# EAGLE design s7-Mini-FPGA Development Board (EAGLE 9.7.0)

## Sheet 1 of 2
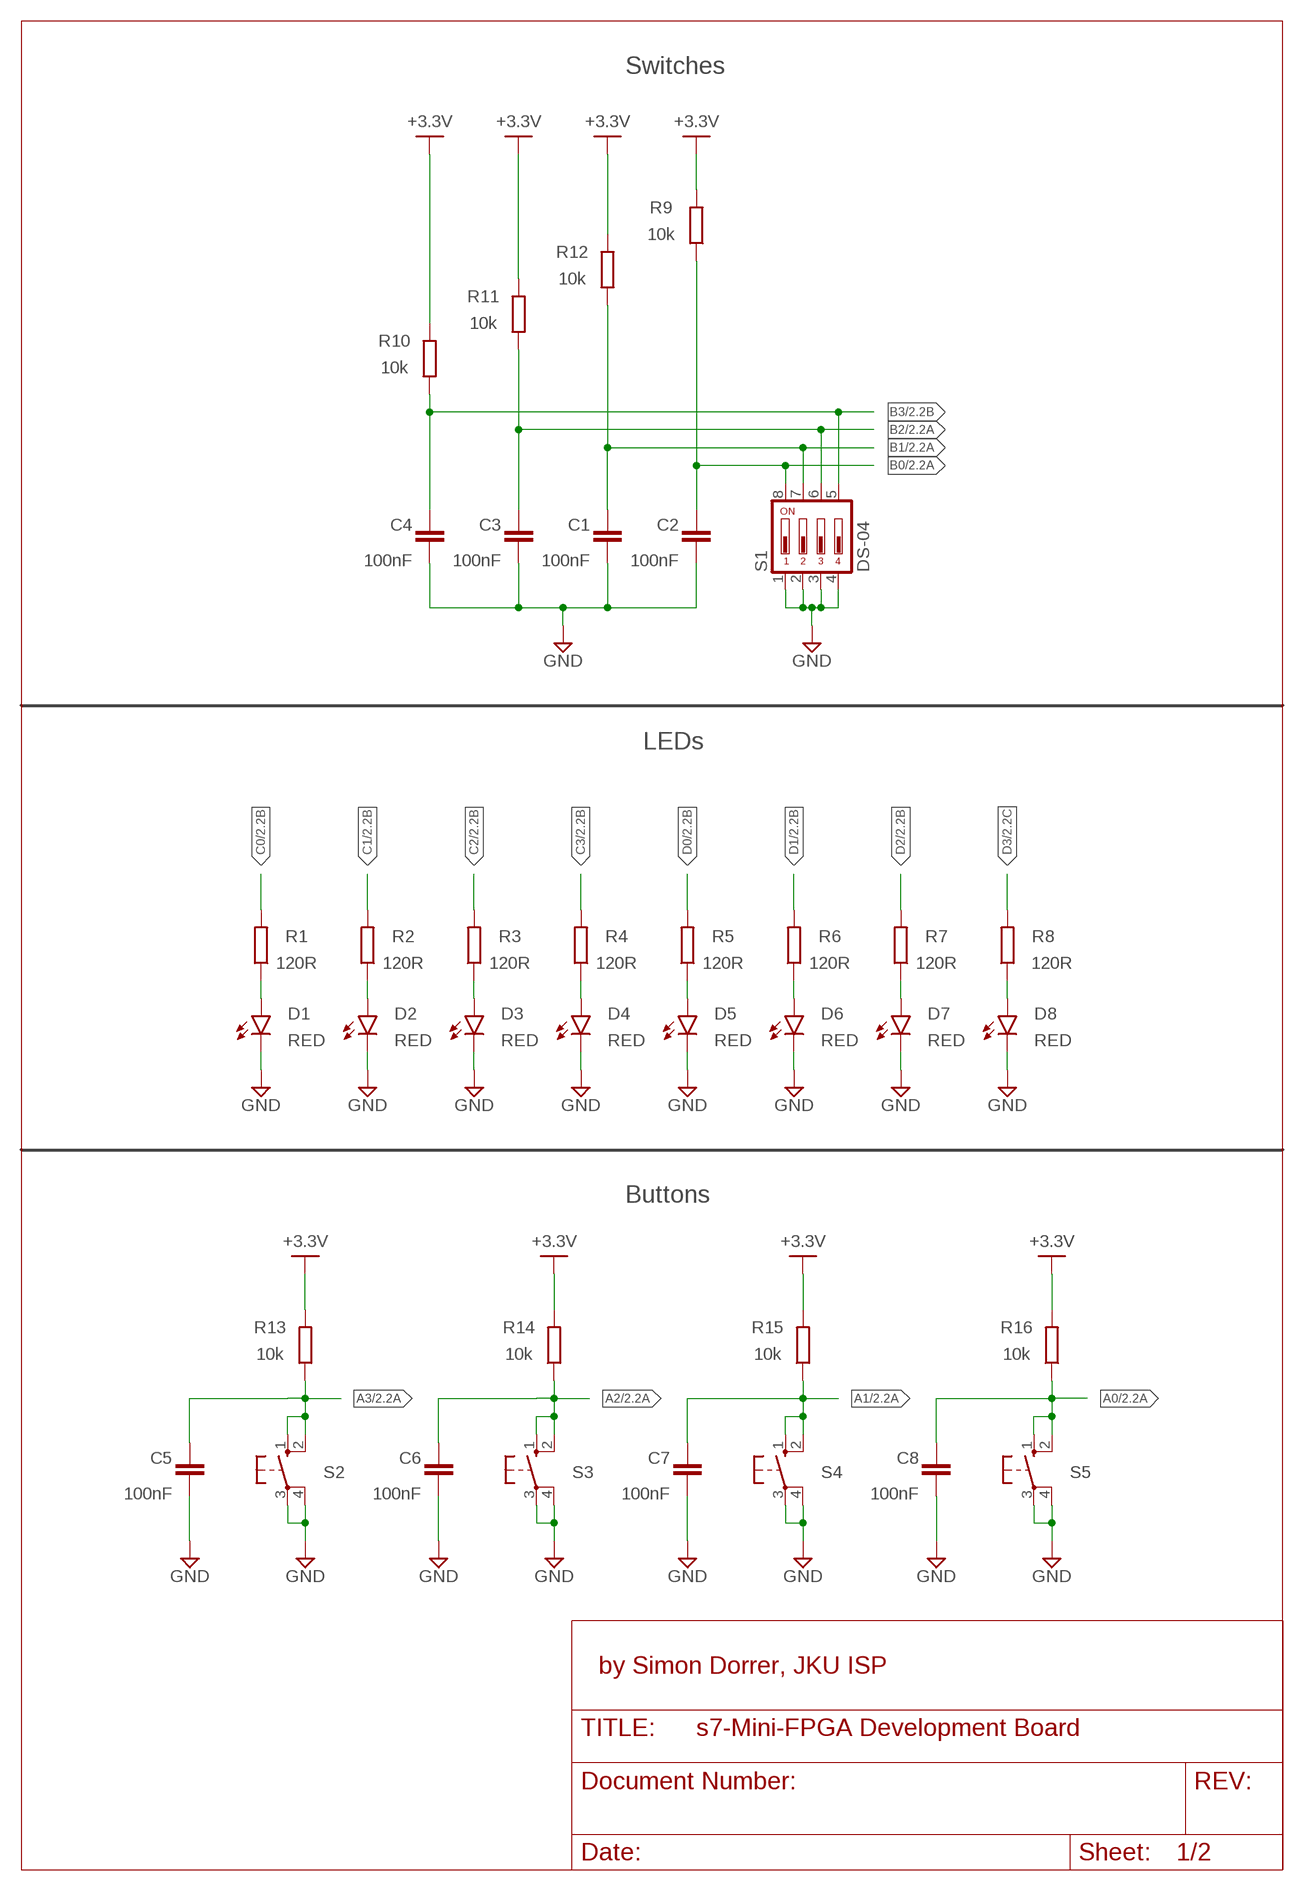
[diagram p0: schematic, sheet 1]

### Parts
C1  100nF  C_CHIP-0805(2012-METRIC)  [CAPC2012X110]
C2  100nF  C_CHIP-0805(2012-METRIC)  [CAPC2012X110]
C3  100nF  C_CHIP-0805(2012-METRIC)  [CAPC2012X110]
C4  100nF  C_CHIP-0805(2012-METRIC)  [CAPC2012X110]
C5  100nF  C_CHIP-0805(2012-METRIC)  [CAPC2012X110]
C6  100nF  C_CHIP-0805(2012-METRIC)  [CAPC2012X110]
C7  100nF  C_CHIP-0805(2012-METRIC)  [CAPC2012X110]
C8  100nF  C_CHIP-0805(2012-METRIC)  [CAPC2012X110]
D1  RED  CHIP-FLAT-R_0805  [LEDC2012X110N_FLAT-R]
D2  RED  CHIP-FLAT-R_0805  [LEDC2012X110N_FLAT-R]
D3  RED  CHIP-FLAT-R_0805  [LEDC2012X110N_FLAT-R]
D4  RED  CHIP-FLAT-R_0805  [LEDC2012X110N_FLAT-R]
D5  RED  CHIP-FLAT-R_0805  [LEDC2012X110N_FLAT-R]
D6  RED  CHIP-FLAT-R_0805  [LEDC2012X110N_FLAT-R]
D7  RED  CHIP-FLAT-R_0805  [LEDC2012X110N_FLAT-R]
D8  RED  CHIP-FLAT-R_0805  [LEDC2012X110N_FLAT-R]
R1  120R  R_CHIP-0805(2012-METRIC)  [RESC2012X65]
R2  120R  R_CHIP-0805(2012-METRIC)  [RESC2012X65]
R3  120R  R_CHIP-0805(2012-METRIC)  [RESC2012X65]
R4  120R  R_CHIP-0805(2012-METRIC)  [RESC2012X65]
R5  120R  R_CHIP-0805(2012-METRIC)  [RESC2012X65]
R6  120R  R_CHIP-0805(2012-METRIC)  [RESC2012X65]
R7  120R  R_CHIP-0805(2012-METRIC)  [RESC2012X65]
R8  120R  R_CHIP-0805(2012-METRIC)  [RESC2012X65]
R9  10k  R_CHIP-0805(2012-METRIC)  [RESC2012X65]
R10  10k  R_CHIP-0805(2012-METRIC)  [RESC2012X65]
R11  10k  R_CHIP-0805(2012-METRIC)  [RESC2012X65]
R12  10k  R_CHIP-0805(2012-METRIC)  [RESC2012X65]
R13  10k  R_CHIP-0805(2012-METRIC)  [RESC2012X65]
R14  10k  R_CHIP-0805(2012-METRIC)  [RESC2012X65]
R15  10k  R_CHIP-0805(2012-METRIC)  [RESC2012X65]
R16  10k  R_CHIP-0805(2012-METRIC)  [RESC2012X65]
S1  DS-04  DS04  [DS-04]
S2  10-XX  [B3F-10XX]
S3  10-XX  [B3F-10XX]
S4  10-XX  [B3F-10XX]
S5  10-XX  [B3F-10XX]

### Nets
+3.3V [Supply]: R9.2 R10.2 R11.2 R12.2 R13.2 R14.2 R15.2 R16.2 ; also sheet 2
A0: C8.1 R16.1 S5.1(S) S5.2(S1) ; also sheet 2
A1: C7.1 R15.1 S4.1(S) S4.2(S1) ; also sheet 2
A2: C6.1 R14.1 S3.1(S) S3.2(S1) ; also sheet 2
A3: C5.1 R13.1 S2.1(S) S2.2(S1) ; also sheet 2
B0: C2.1 R9.1 S1.8 ; also sheet 2
B1: C1.1 R12.1 S1.7 ; also sheet 2
B2: C3.1 R11.1 S1.6 ; also sheet 2
B3: C4.1 R10.1 S1.5 ; also sheet 2
C0: R1.2 ; also sheet 2
C1: R2.2 ; also sheet 2
C2: R3.2 ; also sheet 2
C3: R4.2 ; also sheet 2
D0: R5.2 ; also sheet 2
D1: R6.2 ; also sheet 2
D2: R7.2 ; also sheet 2
D3: R8.2 ; also sheet 2
GND: C1.2 C2.2 C3.2 C4.2 C5.2 C6.2 C7.2 C8.2 D1.C D2.C D3.C D4.C D5.C D6.C D7.C D8.C S1.1 S1.2 S1.3 S1.4 S2.3(P) S2.4(P1) S3.3(P) S3.4(P1) S4.3(P) S4.4(P1) S5.3(P) S5.4(P1) ; also sheet 2
N$24: D1.A R1.1
N$30: D2.A R2.1
N$31: D3.A R3.1
N$32: D4.A R4.1
N$33: D5.A R5.1
N$34: D6.A R6.1
N$35: D7.A R7.1
N$36: D8.A R8.1

### Notes on the sheet
- Switches
- LEDs
- Buttons
- by Simon Dorrer, JKU ISP

## Sheet 2 of 2
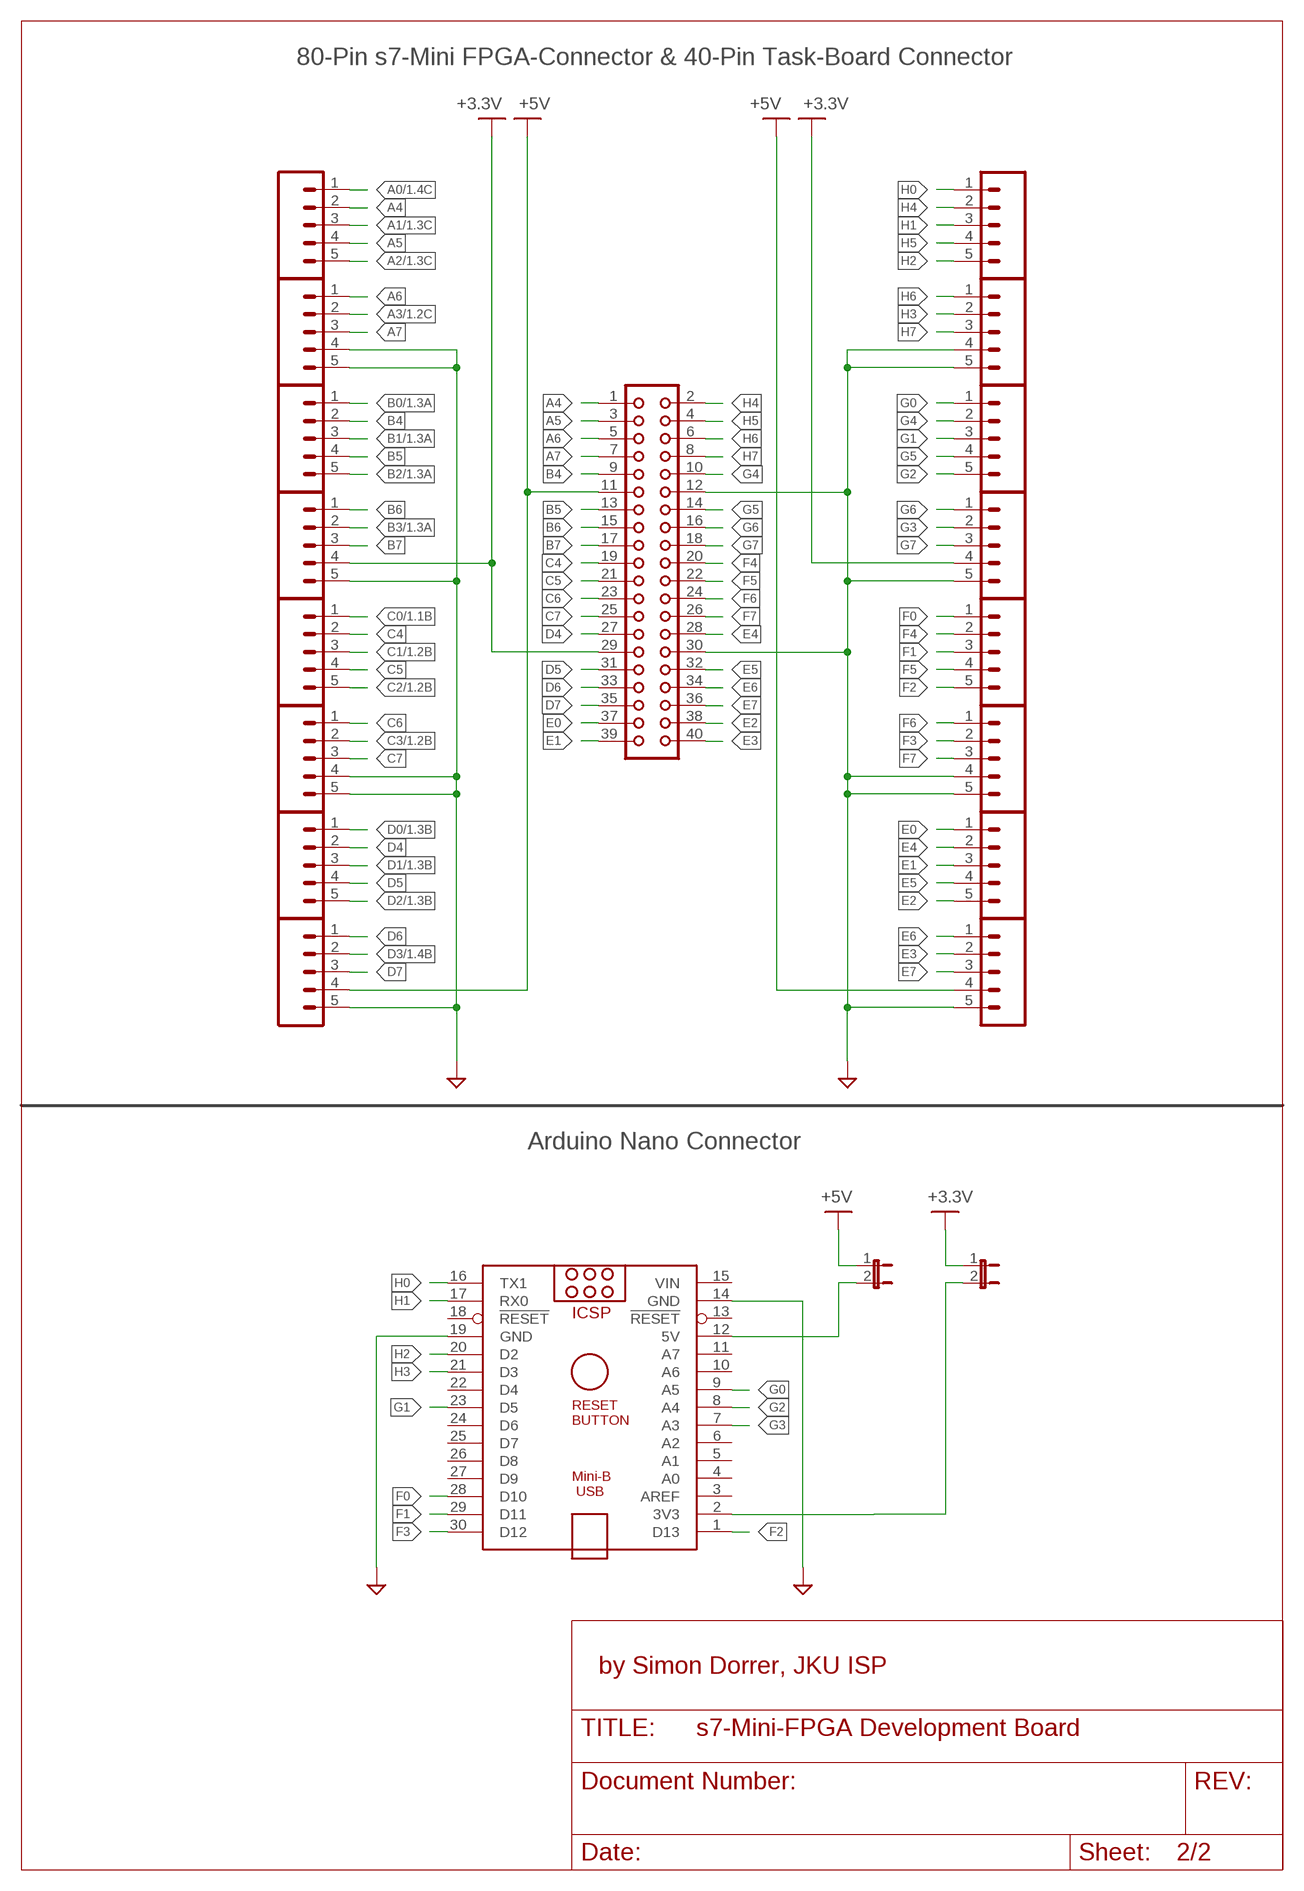
[diagram p1: schematic, sheet 2]

### Parts
J1  CONN_051.27MM  [1X05_1.27MM]
J2  CONN_051.27MM  [1X05_1.27MM]
J3  CONN_051.27MM  [1X05_1.27MM]
J4  CONN_051.27MM  [1X05_1.27MM]
J5  CONN_051.27MM  [1X05_1.27MM]
J6  CONN_051.27MM  [1X05_1.27MM]
J7  CONN_051.27MM  [1X05_1.27MM]
J8  CONN_051.27MM  [1X05_1.27MM]
J9  s7-Mini-Con1  CONN_051.27MM  [1X05_1.27MM]
J10  CONN_051.27MM  [1X05_1.27MM]
J11  CONN_051.27MM  [1X05_1.27MM]
J12  CONN_051.27MM  [1X05_1.27MM]
J13  CONN_051.27MM  [1X05_1.27MM]
J14  CONN_051.27MM  [1X05_1.27MM]
J15  CONN_051.27MM  [1X05_1.27MM]
J16  s7-Mini-Con2  CONN_051.27MM  [1X05_1.27MM]
JP4  JP1E  [JP1]
JP5  JP1E  [JP1]
X1  TASK-CON  CON40  [CON40]
X2  ARDUINO-NANO-CON  ARDUINO_NANO  [ARDUINO_NANO]

### Nets
+3.3V [Supply]: J5.4 J12.4 JP5.1 X1.29 ; also sheet 1
+5V [Supply]: J9.4 J16.4 JP4.1 X1.11
A0: J1.1 ; also sheet 1
A1: J1.3 ; also sheet 1
A2: J1.5 ; also sheet 1
A3: J3.2 ; also sheet 1
A4: J1.2 X1.1
A5: J1.4 X1.3
A6: J3.1 X1.5
A7: J3.3 X1.7
B0: J4.1 ; also sheet 1
B1: J4.3 ; also sheet 1
B2: J4.5 ; also sheet 1
B3: J5.2 ; also sheet 1
B4: J4.2 X1.9
B5: J4.4 X1.13
B6: J5.1 X1.15
B7: J5.3 X1.17
C0: J6.1 ; also sheet 1
C1: J6.3 ; also sheet 1
C2: J6.5 ; also sheet 1
C3: J7.2 ; also sheet 1
C4: J6.2 X1.19
C5: J6.4 X1.21
C6: J7.1 X1.23
C7: J7.3 X1.25
D0: J8.1 ; also sheet 1
D1: J8.3 ; also sheet 1
D2: J8.5 ; also sheet 1
D3: J9.2 ; also sheet 1
D4: J8.2 X1.27
D5: J8.4 X1.31
D6: J9.1 X1.33
D7: J9.3 X1.35
E0: J15.1 X1.37
E1: J15.3 X1.39
E2: J15.5 X1.38
E3: J16.2 X1.40
E4: J15.2 X1.28
E5: J15.4 X1.32
E6: J16.1 X1.34
E7: J16.3 X1.36
F0: J13.1 X2.28(D10)
F1: J13.3 X2.29(D11)
F2: J13.5 X2.1(D13)
F3: J14.2 X2.30(D12)
F4: J13.2 X1.20
F5: J13.4 X1.22
F6: J14.1 X1.24
F7: J14.3 X1.26
G0: J11.1 X2.9(A5)
G1: J11.3 X2.23(D5)
G2: J11.5 X2.8(A4)
G3: J12.2 X2.7(A3)
G4: J11.2 X1.10
G5: J11.4 X1.14
G6: J12.1 X1.16
G7: J12.3 X1.18
GND: J3.4 J3.5 J5.5 J7.4 J7.5 J9.5 J10.4 J10.5 J12.5 J14.4 J14.5 J16.5 X1.12 X1.30 X2.14(GND) X2.19(GND) ; also sheet 1
H0: J2.1 X2.16(TX1)
H1: J2.3 X2.17(RX0)
H2: J2.5 X2.20(D2)
H3: J10.2 X2.21(D3)
H4: J2.2 X1.2
H5: J2.4 X1.4
H6: J10.1 X1.6
H7: J10.3 X1.8
N$38: JP4.2 X2.12(5V)
N$39: JP5.2 X2.2(3V3)
Unconnected: X2.3(AREF) X2.4(A0) X2.5(A1) X2.6(A2) X2.10(A6) X2.11(A7) X2.13(!RESET) X2.18(!RESET) X2.22(D4) X2.24(D6) X2.25(D7) X2.26(D8) X2.27(D9)

### Notes on the sheet
- 80-Pin s7-Mini FPGA-Connector & 40-Pin Task-Board Connector
- +3.3V | +5V | +5V | +3.3V
- Arduino Nano Connector
- +5V | +3.3V
- by Simon Dorrer, JKU ISP

## Power pins joined to a net without a drawn wire
VIN: X2.15(VIN)

## Library data of the parts
C1-C8 = Capacitor:C: Capacitor - Generic; CATEGORY: Capacitor
D1-D8 = LED:CHIP-FLAT-R; CATEGORY: LED; COLOR: RED; DESCRIPTION: CHIP LED FLAT; SUB-CATEGORY: CHIP; TYPE: FLAT_TOP; VALUE: LED_RED
J1-J16 = SparkFun-Connectors:CONN_05: Multi connection point. Often used as Generic Header-pin footprint for 0.1 inch spaced/style header connections On any of the 0.1 inch spaced packages, you can populate with these: Break Away Headers - Straight <https://www.sparkfun.com/products/116> (PRT-00116) Break Away Male Headers - Right Angle <https://www.sparkfun.com/products/553> (PRT-00553) Female Headers <https://www.sparkfun.com/products/115> (PRT-00115) Break Away Headers - Machine Pin <https://www.sparkfun.com/products/117> (PRT-00117) Break Away Female Headers - Swiss Machine Pin <https://www.sparkfun.com/products/743> (PRT-00743) For SCREWTERMINALS and SPRING TERMINALS visit here: Screw Terimnals on SparkFun.com <https://www.sparkfun.com/search/results?term=Screw+Terminals> (5mm/3.5mm/2.54mm spacing) This device is also useful as a general connection point to wire up your design to another part of your project. Our various solder wires solder well into these plated through hole pads. Hook-Up Wire - Assortment (Stranded, 22 AWG) <https://www.sparkfun.com/products/11375> (PRT-11375) Hook-Up Wire - Assortment (Solid Core, 22 AWG) <https://www.sparkfun.com/products/11367> (PRT-11367) View the entire wire category on our website here <https://www.sparkfun.com/categories/141> Special notes: Molex polarized connector foot print use with SKU : PRT-08231 with associated crimp pins and housings. 1MM SMD Version SKU: PRT-10208
JP4 JP5 = jumper:JP1E: JUMPER
R1-R16 = Resistor:R: Resistor Fixed - Generic; CATEGORY: Resistor; SUB-CATEGORY: Fixed
S1 = Switch:DS04: DIL/CODE SWITCH; CATEGORY: SWITCH; MPN: MCNDS-04-V; TYPE: SPST
S2-S5 = switch-omron:10-XX: OMRON SWITCH; MPN: B3F-1000; OC_FARNELL: 176432; OC_NEWARK: 36M3542
X1 = con-harting_modulated:CON40: CONNECTOR; OC_FARNELL: unknown; OC_NEWARK: unknown
X2 = ArduinoNanoV30:ARDUINO_NANO: Arduino Nano V3.0 Overview: The Arduino Nano is a small, complete, and breadboard-friendly board based on the ATmega328 (Arduino Nano 3.x) or ATmega168 (Arduino Nano 2.x). It has more or less the same functionality of the Arduino Duemilanove, but in a different package. It lacks only a DC power jack, and works with a Mini-B USB cable instead of a standard one. The Nano was designed and is being produced by Gravitech. Specifications: Microcontroller Atmel ATmega168 or ATmega328 Operating Voltage (logic level) 5 V Input Voltage (recommended) 7-12 V Input Voltage (limits) 6-20 V Digital I/O Pins 14 (of which 6 provide PWM output) Analog Input Pins 8 DC Current per I/O Pin 40 mA Flash Memory 16 KB (ATmega168) or 32 KB (ATmega328) of which 2 KB used by bootloader SRAM 1 KB (ATmega168) or 2 KB (ATmega328) EEPROM 512 bytes (ATmega168) or 1 KB (ATmega328) Clock Speed 16 MHz Dimensions 0.73" x 1.70" Length 45 mm Width 18 mm Weigth 5 g Power: The Arduino Nano can be powered via the Mini-B USB connection, 6-20V unregulated external power supply (pin 30), or 5V regulated external power supply (pin 27). The power source is automatically selected to the highest voltage source. Memory: The ATmega168 has 16 KB of flash memory for storing code (of which 2 KB is used for the bootloader); the ATmega328 has 32 KB, (also with 2 KB used for the bootloader). The ATmega168 has 1 KB of SRAM and 512 bytes of EEPROM (which can be read and written with the EEPROM library); the ATmega328 has 2 KB of SRAM and 1 KB of EEPROM. Input and Output: Each of the 14 digital pins on the Nano can be used as an input or output, using pinMode(), digitalWrite(), and digitalRead() functions. They operate at 5 volts. Each pin can provide or receive a maximum of 40 mA and has an internal pull-up resistor (disconnected by default) of 20-50 kOhms. In addition, some pins have specialized functions. Visit Arduino - ArduinoBoardNano <https://www.arduino.cc/en/Main/ArduinoBoardNano>

## Net classes
0 default: width 0.3 mm
1 Supply: width 0.4 mm

## Board
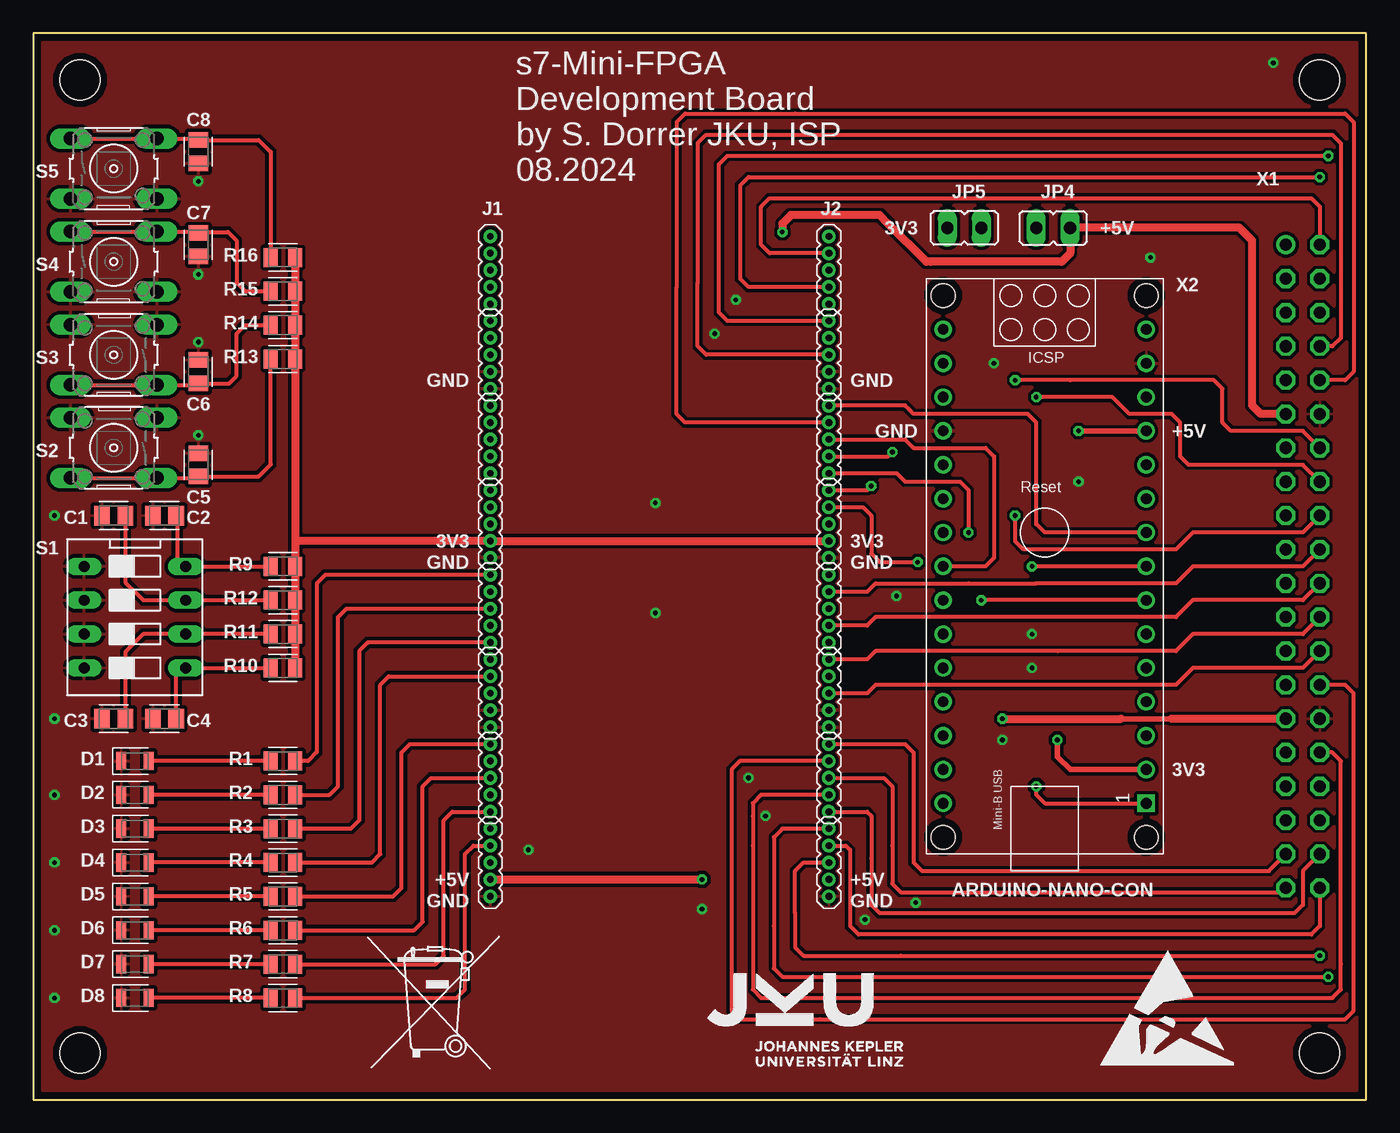
[diagram p2: board, top side]
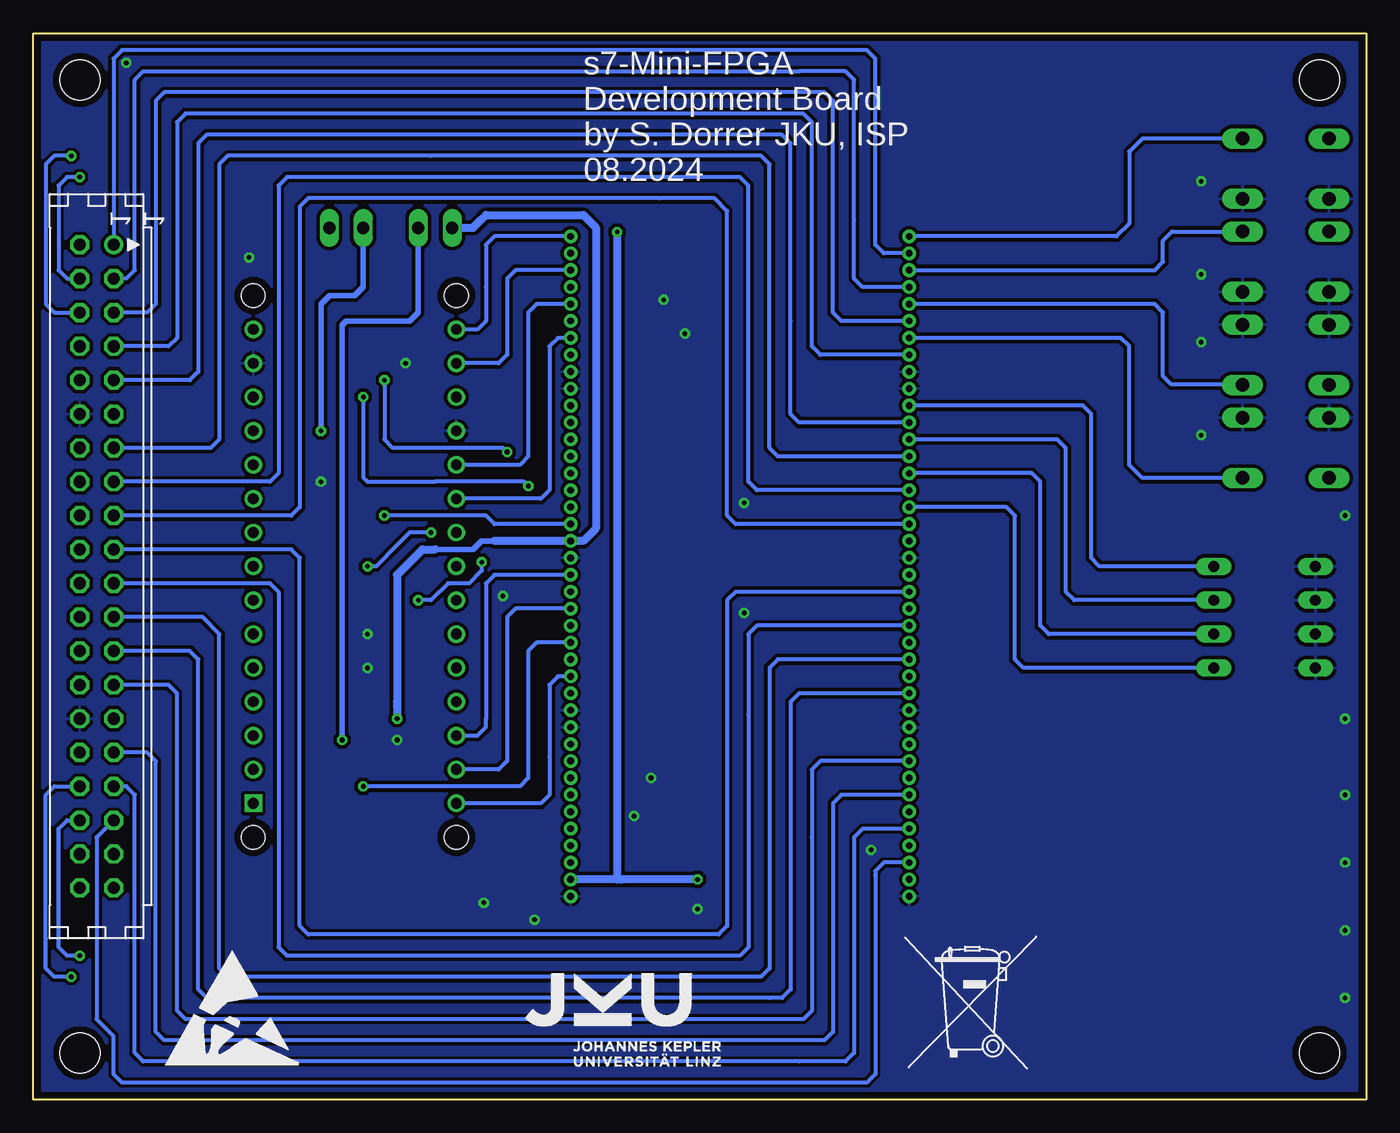
[diagram p3: board, bottom side, seen from below]

Size 100 x 80 mm. Coordinates in mm from the lower left corner, seen from the top.
Outline: 0,0 100,0 100,80 0,80 0,0
Copper layers (1*16): Top / Bottom
Stack-up Default Layer Stack: Top User Defined 0.035mm / Dielectric-1 User Defined 1.5mm / Bottom User Defined 0.035mm
Design rules: minimum copper width class=1 0.4mm, minimum copper width class=0 0.3mm, minimum copper width 10mil, minimum drill size 0.35mm, copper clearance wire_polygon to wire_polygon 10mil, copper clearance wire_polygon to pad_smd 10mil, copper clearance wire_polygon to via 10mil, copper clearance pad_smd to pad_smd 10mil, copper clearance pad_smd to via 10mil, copper clearance via to via 10mil, copper clearance smd to pad (same net) 6mil, copper clearance smd to via (same net) 6mil, copper clearance smd to smd (same net) 6mil, dimension clearance 20mil, via restrict clearance 0mil, restrict clearance 0mil, drill distance 6mil, keepout clearance 0mil
Holes 3 mm at 3.5,3.5 96.5,3.5 3.5,76.5 96.5,76.5

### Footprints (pad centres in the part's own frame; a part is rotated, then mirrored left to right if it is on the bottom)
CAPC2012X110 = smd 1.165 x 1.465: 1 -0.875,0; 2 0.875,0
LEDC2012X110N_FLAT-R = smd 0.762 x 1.362: A 1.025,0; C -1.025,0
1X05_1.27MM = drill 0.508 pad 1: 1 0,0; 2 1.27,0; 3 2.54,0; 4 3.81,0; 5 5.08,0
JP1 = drill 0.914 long: 1 0,-1.27; 2 0,1.27
RESC2012X65 = smd 1.031 x 1.42: 1 -0.919,0; 2 0.919,0
DS-04 = drill 0.813 long: 1 -3.81,-3.81; 2 -1.27,-3.81; 3 1.27,-3.81; 4 3.81,-3.81; 5 3.81,3.81; 6 1.27,3.81; 7 -1.27,3.81; 8 -3.81,3.81
B3F-10XX = drill 1.016 long: 1 -3.251,2.261; 2 3.251,2.261; 3 -3.251,-2.261; 4 3.251,-2.261
CON40 = drill 0.914: 1 -24.13,-1.27 | drill 0.914 octagon: 2 -24.13,1.27; 3 -21.59,-1.27; 4 -21.59,1.27; 5 -19.05,-1.27; 6 -19.05,1.27; 7 -16.51,-1.27; 8 -16.51,1.27; 9 -13.97,-1.27; 10 -13.97,1.27; 11 -11.43,-1.27; 12 -11.43,1.27; 13 -8.89,-1.27; 14 -8.89,1.27; 15 -6.35,-1.27; 16 -6.35,1.27; 17 -3.81,-1.27; 18 -3.81,1.27; 19 -1.27,-1.27; 20 -1.27,1.27; 21 1.27,-1.27; 22 1.27,1.27; 23 3.81,-1.27; 24 3.81,1.27; 25 6.35,-1.27; 26 6.35,1.27; 27 8.89,-1.27; 28 8.89,1.27; 29 11.43,-1.27; 30 11.43,1.27; 31 13.97,-1.27; 32 13.97,1.27; 33 16.51,-1.27; 34 16.51,1.27; 35 19.05,-1.27; 36 19.05,1.27; 37 21.59,-1.27; 38 21.59,1.27; 39 24.13,-1.27; 40 24.13,1.27
ARDUINO_NANO = drill 0.8 square: 1 -20.32,-7.62 | drill 0.8: 2 -17.78,-7.62; 3 -15.24,-7.62; 4 -12.7,-7.62; 5 -10.16,-7.62; 6 -7.62,-7.62; 7 -5.08,-7.62; 8 -2.54,-7.62; 9 0,-7.62; 10 2.54,-7.62; 11 5.08,-7.62; 12 7.62,-7.62; 13 10.16,-7.62; 14 12.7,-7.62; 15 15.24,-7.62; 16 15.24,7.62; 17 12.7,7.62; 18 10.16,7.62; 19 7.62,7.62; 20 5.08,7.62; 21 2.54,7.62; 22 0,7.62; 23 -2.54,7.62; 24 -5.08,7.62; 25 -7.62,7.62; 26 -10.16,7.62; 27 -12.7,7.62; 28 -15.24,7.62; 29 -17.78,7.62; 30 -20.32,7.62 | hole 1.778: -22.86,-7.62; -22.86,7.62; 17.78,7.62; 17.78,-7.62

### Placement (x,y rotation side)
C1  6.03,43.81 180 top
C2  9.84,43.81 180 top
C3  6.03,28.57 180 top
C4  9.84,28.57 180 top
C5  12.38,47.62 90 top
C6  12.38,54.61 90 top
C7  12.38,64.14 270 top
C8  12.38,71.12 270 top
D1  7.62,25.4 0 top
D2  7.62,22.86 0 top
D3  7.62,20.32 0 top
D4  7.62,17.78 0 top
D5  7.62,15.24 0 top
D6  7.62,12.7 0 top
D7  7.62,10.16 0 top
D8  7.62,7.62 0 top
J1  34.29,64.77 270 top
J2  59.69,64.77 270 top
J3  34.29,58.42 270 top
J4  34.29,52.07 270 top
J5  34.29,45.72 270 top
J6  34.29,39.37 270 top
J7  34.29,33.02 270 top
J8  34.29,26.67 270 top
J9  34.29,20.32 270 top
J10  59.69,58.42 270 top
J11  59.69,52.07 270 top
J12  59.69,45.72 270 top
J13  59.69,39.37 270 top
J14  59.69,33.02 270 top
J15  59.69,26.67 270 top
J16  59.69,20.32 270 top
JP4  76.52,65.41 90 top
JP5  69.85,65.41 270 top
R1  18.73,25.4 0 top
R2  18.73,22.86 0 top
R3  18.73,20.32 0 top
R4  18.73,17.78 0 top
R5  18.73,15.24 0 top
R6  18.73,12.7 0 top
R7  18.73,10.16 0 top
R8  18.73,7.62 0 top
R9  18.73,40.01 0 top
R10  18.73,32.38 0 top
R11  18.73,34.92 0 top
R12  18.73,37.47 0 top
R13  18.73,55.56 0 top
R14  18.73,58.1 0 top
R15  18.73,60.64 0 top
R16  18.73,63.18 0 top
S1  7.62,36.2 270 top
S2  6.03,48.9 180 top
S3  6.03,55.88 180 top
S4  6.03,62.87 0 top
S5  6.03,69.85 0 top
U$1  [ESD_10.00]  80.01,2.54 0 top
U$2  [ESD_10.00]  90.17,2.54 0 bottom
U$3  [MUELLTONNE_10.00]  24.45,1.91 0 top
U$4  [MUELLTONNE_10.00]  35.24,1.91 0 bottom
X1  95.25,40.01 270 top
X2  75.88,42.55 90 top

### Tracks (layer width: path | path; a pad name or v marks a point on that pad's centre or on a via)
+3.3V  (via drill 0.35)
  Top 0.4: 81.6,28.57 85.41,28.57
  Top 0.6: R10.2 R11.2 R12.2 R9.2 19.65,41.91 | R16.2 R15.2 R14.2 R13.2 19.65,41.91 | 19.65,41.91 J5.4 J12.4 | X1.29 85.41,28.57 | v72.71,28.57 81.6,28.57
  Bottom 0.4: 65.41,41.91 66.36,41.91 66.99,41.27 69.85,41.27
  Bottom 0.6: JP5.1 66.99,65.41 66.36,66.04 66.04,66.36 58.74,66.36 57.78,65.41 57.78,42.86 58.74,41.91 J12.4 65.41,41.91 | v72.71,28.57 72.71,29.53 72.71,29.84 72.71,39.37 70.8,41.27 69.85,41.27
+5V  (via drill 0.35)
  Top 0.6: J9.4 v50.16,16.51 | X1.11 92.08,51.44 91.44,52.07 91.44,64.45 90.49,65.41 JP4.1 77.79,63.5 77.15,62.87 67.31,62.87 66.99,62.87 64.14,65.72 63.5,66.36 63.18,66.36 56.83,66.36 56.2,65.72 v56.2,65.09
  Bottom 0.6: v50.16,16.51 55.88,16.51 56.2,16.51 | 56.2,16.51 J16.4 | v56.2,65.09 56.2,16.51
A0
  Top 0.3: S5.2 9.53,72.11 | 9.53,72.11 12.27,72.11 C8.1 16.91,72 17.78,71.12 17.81,71.09 R16.1 | S5.1 9.53,72.11
  Bottom 0.3: S5.2 16.79,72.11 17.78,71.12 17.78,65.72 18.73,64.77 J1.1
A1
  Top 0.3: S4.1 S4.2 12.27,65.13 C7.1 12.46,65.09 14.61,65.09 15.24,64.45 15.24,61.28 15.88,60.64 R15.1
  Bottom 0.3: S4.2 14.57,65.13 15.24,64.45 15.24,62.87 15.88,62.23 J1.3
A2
  Top 0.3: S3.2 S3.1 12.27,53.62 C6.1 14.68,53.73 15.24,54.29 15.24,57.47 15.88,58.1 R14.1
  Bottom 0.3: S3.1 9.32,53.66 14.61,53.66 15.24,54.29 15.24,59.05 15.88,59.69 J1.5
A3
  Top 0.3: S2.2 S2.1 12.27,46.63 C5.1 16.91,46.75 17.81,47.66 R13.1
  Bottom 0.3: S2.1 16.79,46.63 17.78,47.62 17.78,56.52 18.41,57.15 J3.2
A4
  Bottom 0.3: J1.2 36.2,63.5 36.83,64.14 36.83,78.11 37.47,78.74 93.34,78.74 93.98,78.11 X1.1
A5
  Bottom 0.3: J1.4 37.78,60.96 38.42,61.59 38.42,66.04 38.42,76.52 39.05,77.15 42.55,77.15 91.76,77.15 92.39,76.52 92.39,62.23 93.03,61.59 X1.3
A6
  Bottom 0.3: J3.1 39.37,58.42 40.01,59.05 40.01,74.93 40.64,75.56 46.67,75.56 90.17,75.56 90.81,74.93 90.81,59.69 91.44,59.05 X1.5
A7
  Bottom 0.3: J3.3 40.96,55.88 41.59,56.52 41.59,62.87 41.59,73.34 42.23,73.98 48.26,73.98 88.58,73.98 89.22,73.34 89.22,57.15 89.85,56.52 X1.7
B0
  Top 0.3: C2.1 10.79,43.74 10.79,40.32 11.11,40.01 S1.8 R9.1
  Bottom 0.3: S1.8 20,40.01 20.64,40.64 20.64,51.44 21.27,52.07 J4.1
B1
  Top 0.3: C1.1 6.91,38.81 8.26,37.47 S1.7 R12.1
  Bottom 0.3: S1.7 21.91,37.47 22.54,38.1 22.54,48.9 23.18,49.53 J4.3
B2
  Top 0.3: C3.1 6.91,33.58 6.99,33.66 8.26,34.92 S1.6 R11.1
  Bottom 0.3: S1.6 23.81,34.92 24.45,35.56 24.45,46.35 25.08,46.99 J4.5
B3
  Top 0.3: C4.1 10.72,31.99 11.11,32.38 S1.5 R10.1
  Bottom 0.3: S1.5 25.72,32.38 26.35,33.02 26.35,43.81 26.99,44.45 J5.2
B4
  Bottom 0.3: J4.2 42.55,50.8 43.18,51.44 43.18,58.42 43.18,71.75 43.81,72.39 87,72.39 87.63,71.75 87.63,54.61 88.27,53.98 X1.9
B5
  Bottom 0.3: J4.4 44.13,48.26 44.77,48.9 44.77,70.17 45.4,70.8 70.17,70.8 85.41,70.8 86.04,70.17 86.04,49.53 86.68,48.9 X1.13
B6
  Bottom 0.3: J5.1 45.72,45.72 46.35,46.35 46.35,68.58 46.99,69.22 70.48,69.22 80.96,69.22 81.6,68.58 81.6,46.99 82.23,46.35 X1.15
B7
  Bottom 0.3: J5.3 47.31,43.18 47.94,43.81 47.94,66.67 48.9,67.63 53.02,67.63 79.38,67.63 80.01,66.99 80.01,44.45 80.64,43.81 X1.17
C0
  Top 0.3: R1.2 20.61,25.4 21.27,26.07 21.27,38.73 21.91,39.37 J6.1
C1
  Top 0.3: R2.2 22.23,22.86 22.86,23.5 22.86,36.2 23.5,36.83 J6.3
C2
  Top 0.3: R3.2 23.81,20.32 24.45,20.95 24.45,33.66 25.08,34.29 J6.5
C3
  Top 0.3: R4.2 24.45,17.78 25.4,17.78 26.04,18.41 26.04,31.11 26.67,31.75 J7.2
C4
  Bottom 0.3: J6.2 47.31,38.1 47.94,37.47 47.94,34.61 47.94,27.62 47.94,13.02 48.58,12.38 79.38,12.38 80.01,13.02 80.01,40.64 80.64,41.27 X1.19
C5
  Bottom 0.3: J6.4 45.72,35.56 46.35,34.92 46.35,28.89 46.35,11.43 46.99,10.79 53.98,10.79 80.96,10.79 81.6,11.43 81.6,38.1 82.23,38.73 X1.21
C6
  Bottom 0.3: J7.1 44.13,33.02 44.77,32.38 44.77,9.84 45.4,9.21 46.99,9.21 85.41,9.21 86.04,9.84 86.04,34.92 87.31,36.2 X1.23
C7
  Bottom 0.3: J7.3 42.55,30.48 43.18,29.84 43.18,8.26 43.81,7.62 44.77,7.62 87,7.62 87.63,8.26 87.63,33.02 88.27,33.66 X1.25
D0
  Top 0.3: R5.2 26.99,15.24 27.62,15.88 27.62,26.04 28.26,26.67 J8.1
D1
  Top 0.3: R6.2 28.57,12.7 29.21,13.34 29.21,23.5 29.84,24.13 J8.3
D2
  Top 0.3: R7.2 30.16,10.16 30.8,10.79 30.8,20.95 31.43,21.59 J8.5
D3
  Top 0.3: R8.2 31.75,7.62 32.38,8.26 32.38,18.41 33.02,19.05 J9.2
D4
  Bottom 0.3: J8.2 40.96,25.4 41.59,24.77 41.59,19.68 41.59,6.67 42.23,6.03 44.77,6.03 88.58,6.03 89.22,6.67 89.22,30.48 89.85,31.11 X1.27
D5
  Bottom 0.3: J8.4 39.37,22.86 40.01,22.23 40.01,5.08 40.64,4.45 46.04,4.45 90.17,4.45 90.81,5.08 90.81,25.4 91.44,26.04 X1.31
D6
  Bottom 0.3: J9.1 37.78,20.32 38.1,20 38.42,19.68 38.42,10.48 38.42,3.49 39.05,2.86 42.55,2.86 91.76,2.86 92.39,3.49 92.39,22.86 93.03,23.5 X1.33
D7
  Bottom 0.3: J9.3 36.2,17.78 36.83,17.14 36.83,16.83 36.83,1.91 37.15,1.59 37.47,1.27 90.81,1.27 93.34,1.27 93.98,1.91 93.98,4.76 94.84,5.62 95.25,6.03 95.25,19.68 X1.35
E0
  Top 0.3: J15.1 60.64,26.67 65.41,26.67 65.72,26.35 66.04,26.04 66.04,19.68 66.04,17.78 66.67,17.14 80.64,17.14 92.71,17.14 X1.37
E1
  Top 0.3: J15.3 63.82,24.13 64.45,23.5 64.45,19.05 64.45,16.19 65.09,15.56 93.66,15.56 X1.39
E2
  Top 0.3: J15.5 62.55,21.59 62.87,21.27 62.87,18.1 62.87,14.61 63.5,13.97 94.61,13.97 95.25,14.61 95.25,17.14 X1.38
E3
  Top 0.3: J16.2 60.96,19.05 61.28,18.73 61.28,13.02 61.91,12.38 95.89,12.38 96.52,13.02 X1.40
E4
  Top 0.3: J15.2 53.02,25.4 52.39,24.77 52.39,6.67 53.02,6.03 59.05,6.03 98.42,6.03 99.06,6.67 99.06,30.48 98.42,31.11 X1.28
E5
  Top 0.3: J15.4 54.61,22.86 53.98,22.23 53.98,21.27 53.98,19.05 53.98,8.26 54.61,7.62 97.47,7.62 98.11,8.26 98.11,10.16 98.11,25.4 97.47,26.04 X1.32
E6  (via drill 0.35)
  Top 0.3: J16.1 56.2,20.32 55.56,19.68 55.56,13.02 55.56,9.84 56.2,9.21 v97.16,9.21
  Bottom 0.3: v97.16,9.21 98.42,9.21 99.06,9.84 99.06,12.06 99.06,22.86 98.42,23.5 X1.34
E7  (via drill 0.35)
  Top 0.3: J16.3 57.78,17.78 57.15,17.14 57.15,13.97 57.15,11.43 57.78,10.79 65.09,10.79 v96.52,10.79
  Bottom 0.3: v96.52,10.79 97.47,10.79 98.11,11.43 98.11,20.32 97.47,20.95 X1.36
F0
  Bottom 0.3: J13.1 65.41,39.37 66.04,38.73 66.04,28.57 66.04,27.94 66.67,27.3 X2.28
F1
  Bottom 0.3: J13.3 63.82,36.83 64.45,36.2 64.45,33.34 64.45,25.4 65.09,24.77 X2.29
F2  (via drill 0.35)
  Top 0.3: v75.25,23.5 75.25,22.86 75.88,22.23 X2.1
  Bottom 0.3: J13.5 62.23,34.29 62.87,33.66 62.87,24.13 63.5,23.5 v75.25,23.5
F3
  Bottom 0.3: J14.2 60.64,31.75 61.28,31.11 61.28,25.72 61.28,22.86 61.91,22.23 X2.30
F4
  Top 0.3: X1.20 95.25,40.01 87,40.01 85.72,38.73 75.25,38.73 70.17,38.73 63.18,38.73 62.55,38.1 J13.2
F5
  Top 0.3: X1.22 95.25,37.47 87,37.47 85.72,36.2 63.18,36.2 62.55,35.56 J13.4
F6
  Top 0.3: X1.24 95.25,34.92 87,34.92 85.72,33.66 76.83,33.66 63.18,33.66 62.55,33.02 J14.1
F7
  Top 0.3: X1.26 95.25,32.38 87,32.38 85.72,31.11 76.52,31.11 63.18,31.11 62.55,30.48 J14.3
G0
  Top 0.3: J11.1 65.41,52.07 65.72,51.75 66.04,51.44 74.61,51.44 75.25,50.8 75.25,43.18 75.88,42.55 X2.9
G1
  Top 0.3: J11.3 65.41,49.53 66.04,48.9 71.44,48.9 72.07,48.26 72.07,42.55 72.07,40.64 71.44,40.01 X2.23
G2  (via drill 0.35)
  Top 0.3: J11.5 64.77,46.99 65.41,46.35 69.53,46.35 70.17,45.72 v70.17,42.55 | X2.8 v74.93,40.01
  Bottom 0.3: v70.17,42.55 71.75,42.55 72.71,41.59 74.3,40.01 74.61,40.01 v74.93,40.01
G3  (via drill 0.35)
  Top 0.3: J12.2 62.23,44.45 62.87,43.81 62.87,40.96 63.5,40.32 v66.36,40.32 | X2.7 v71.12,37.47
  Bottom 0.3: v66.36,40.32 66.36,40.01 66.36,39.69 67.31,38.73 68.9,38.73 70.17,37.47 v71.12,37.47
G4
  Top 0.3: J11.2 48.9,50.8 48.26,51.44 48.26,60.96 48.26,73.34 48.9,73.98 57.15,73.98 98.42,73.98 99.06,73.34 99.06,54.61 98.42,53.98 X1.10
G5  (via drill 0.35)
  Top 0.3: J11.4 64.14,48.26 v64.45,48.58 | X1.14 95.25,50.16 89.85,50.16 89.22,50.8 89.22,53.34 88.58,53.98 77.79,53.98 v73.66,53.98
  Bottom 0.3: v64.45,48.58 64.77,48.9 69.85,48.9 73.03,48.9 73.66,49.53 v73.66,53.98
G6  (via drill 0.35)
  Top 0.3: J12.1 62.55,45.72 v62.87,46.04 | X1.16 95.25,47.62 86.68,47.62 86.04,48.26 86.04,49.85 86.04,50.8 85.41,51.44 82.55,51.44 82.23,51.44 81.28,52.39 80.96,52.7 v75.25,52.7
  Bottom 0.3: v62.87,46.04 63.18,46.35 69.85,46.35 74.93,46.35 75.25,46.67 v75.25,52.7
G7  (via drill 0.35)
  Top 0.3: X1.18 95.25,42.55 87,42.55 85.72,41.27 79.69,41.27 79.06,41.27 74.3,41.27 73.66,41.91 v73.66,43.81
  Bottom 0.3: J12.3 65.41,43.18 66.04,43.81 v73.66,43.81
GND  (via drill 0.35)
  other vias: 12.38,68.9 12.38,61.91 12.38,56.83 12.38,49.85 1.59,28.57 1.59,43.81 1.59,22.86 1.59,17.78 1.59,12.7 1.59,7.62 46.67,44.77 46.67,36.51 37.15,18.73 50.16,14.29 93.03,77.79 72.71,26.99 72.07,55.24 78.42,46.35 83.82,63.18 62.39,13.49 66.2,14.76 74.93,34.92 74.93,32.38 64.77,37.78 53.66,24.13 54.93,21.27 51.12,57.47 52.7,60.01
  pour Bottom (isolate 0.254): 0,80 100,80 100,0 0,0
  pour Top (isolate 0.254): 0,80 100,80 100,0 0,0
H0
  Bottom 0.3: J2.1 65.41,64.77 66.04,64.14 66.04,60.96 66.04,58.42 66.67,57.78 X2.16
H1
  Bottom 0.3: J2.3 63.82,62.23 64.45,61.59 64.45,55.88 65.09,55.24 X2.17
H2
  Bottom 0.3: J2.5 62.23,59.69 62.87,59.05 62.87,58.42 62.87,49.53 62.87,48.26 63.5,47.62 X2.20
H3
  Bottom 0.3: J10.2 60.64,57.15 61.28,56.52 61.28,45.72 61.91,45.09 X2.21
H4
  Top 0.3: J2.2 55.24,63.5 54.61,64.14 54.61,66.99 55.24,67.63 95.89,67.63 96.52,66.99 X1.2
H5  (via drill 0.35)
  Top 0.3: J2.4 53.66,60.96 53.02,61.59 53.02,64.45 53.02,68.58 53.66,69.22 v96.52,69.22
  Bottom 0.3: v96.52,69.22 97.47,69.22 98.11,68.58 98.11,62.23 97.47,61.59 X1.4
H6  (via drill 0.35)
  Top 0.3: J10.1 52.07,58.42 51.44,59.05 51.44,70.17 52.07,70.8 59.69,70.8 v97.16,70.8
  Bottom 0.3: v97.16,70.8 98.42,70.8 99.06,70.17 99.06,59.69 98.42,59.05 X1.6
H7
  Top 0.3: J10.3 50.48,55.88 49.85,56.52 49.85,61.28 49.85,71.75 50.48,72.39 95.57,72.39 97.47,72.39 97.79,72.07 98.11,71.75 98.11,57.15 97.47,56.52 X1.8
N$24
  Top 0.3: R1.1 D1.A
N$30
  Top 0.3: R2.1 D2.A
N$31
  Top 0.3: R3.1 D3.A
N$32
  Top 0.3: R4.1 D4.A
N$33
  Top 0.3: R5.1 D5.A
N$34
  Top 0.3: R6.1 D6.A
N$35
  Top 0.3: R7.1 D7.A
N$36
  Top 0.3: R8.1 D8.A
N$38  (via drill 0.35)
  Top 0.4: v78.42,50.16 X2.12
  Bottom 0.4: JP4.2 75.25,60.96 75.88,60.33 77.79,60.33 78.42,59.69 78.42,55.24 v78.42,50.16
N$39  (via drill 0.35)
  Top 0.4: X2.2 77.79,24.77 76.83,25.72 76.83,26.35 v76.83,26.99
  Bottom 0.4: v76.83,26.99 76.83,47.94 76.83,58.1 76.52,58.42 71.75,58.42 71.12,59.05 JP5.2

### Text on the board
SilkscreenTop: s7-Mini-FPGA / Development Board / by S. Dorrer JKU, ISP / 08.2024 | 3V3 | +5V | GND | GND | GND | +5V | 3V3 | 3V3 | GND | GND | 3V3 | +5V | +5V | GND | GND
SilkscreenBottom: s7-Mini-FPGA / Development Board / by S. Dorrer JKU, ISP / 08.2024